# EAGLE design mDotBreakout (EAGLE 7.1.0)
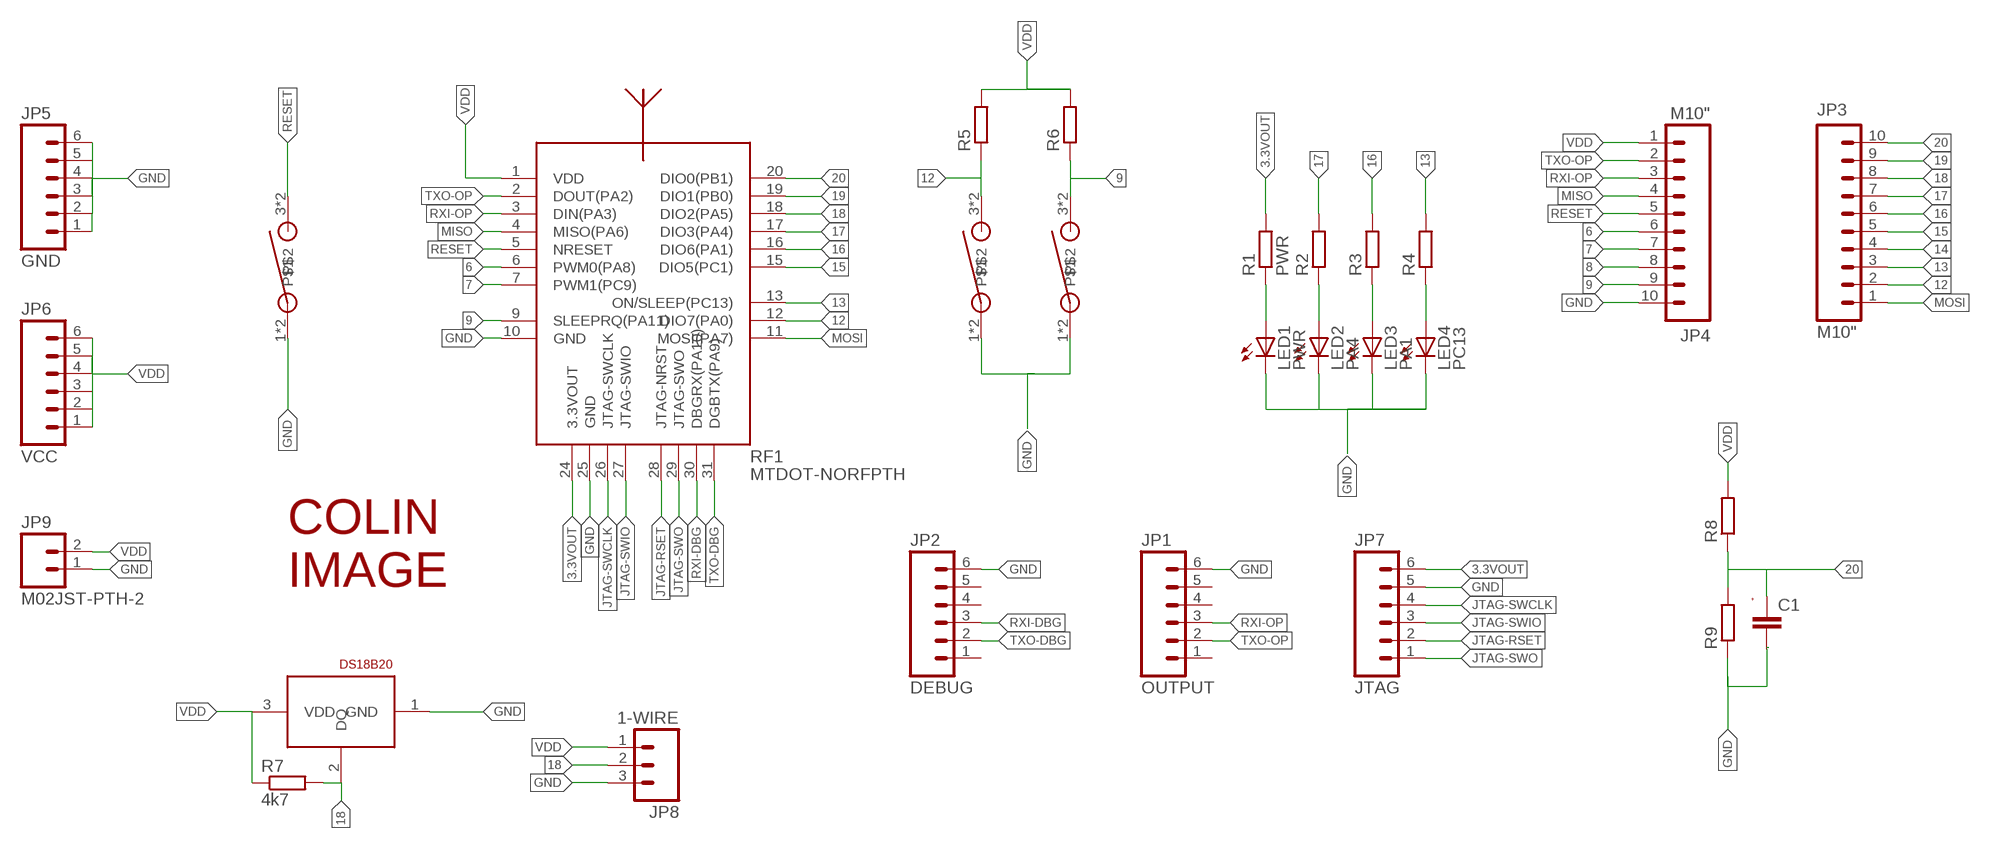
[diagram p0: schematic, sheet 1]

## Parts
C1  C-EUC0805K  [C0805K]
JP1  OUTPUT  M06SIP  [1X06]
JP2  DEBUG  M06SIP  [1X06]
JP3  M10"  [1X10]
JP4  M10"  [1X10]
JP5  GND  M06SIP  [1X06]
JP6  VCC  M06SIP  [1X06]
JP7  JTAG  M06SIP  [1X06]
JP8  1-WIRE  M03JST-PTH  [JST-3-PTH]
JP9  M02JST-PTH-2  [JST-2-PTH]
LED1  PWR  LEDCHIPLED_0805  [CHIPLED_0805]
LED2  PA4  LEDCHIPLED_0805  [CHIPLED_0805]
LED3  PA1  LEDCHIPLED_0805  [CHIPLED_0805]
LED4  PC13  LEDCHIPLED_0805  [CHIPLED_0805]
R1  PWR  R-EUR0805  [R0805]
R2  R-EUR0805  [R0805]
R3  R-EUR0805  [R0805]
R4  R-EUR0805  [R0805]
R5  R-EUR0805  [R0805]
R6  R-EUR0805  [R0805]
R7  4k7  R-EUR0805  [R0805]
R8  R-EUR0805  [R0805]
R9  R-EUR0805  [R0805]
RF1  MTDOT-NORFPTH  [MTDOT-M1-TRC-PTH-NORF]
RST  SWITCH_SPSTPTS645_SMT  [PTS645_SMT]
U$2  SWITCH_SPSTPTS645_SMT  [PTS645_SMT]
U$3  SWITCH_SPSTPTS645_SMT  [PTS645_SMT]
U$4  DS18B20TO92  [TO92]
U$5  COLIN  [COLIN]

## Nets
3.3VOUT: JP7.6 R1.2 RF1.24(3.3VOUT)
6: JP4.6 RF1.6(PWM0(PA8))
7: JP4.7 RF1.7(PWM1(PC9))
8: JP4.8
9: JP4.9 R6.1 RF1.9(SLEEPRQ(PA11)) U$3.3 U$3.4
12: JP3.2 R5.1 RF1.12(DIO7(PA0)) U$2.3 U$2.4
13: JP3.3 R4.2 RF1.13(ON/SLEEP(PC13))
14: JP3.4
15: JP3.5 RF1.15(DIO5(PC1))
16: JP3.6 R3.2 RF1.16(DIO6(PA1))
17: JP3.7 R2.2 RF1.17(DIO3(PA4))
18: JP3.8 JP8.2 R7.2 RF1.18(DIO2(PA5)) U$4.2(DQ)
19: JP3.9 RF1.19(DIO1(PB0))
20: C1.1 JP3.10 R8.1 R9.2 RF1.20(DIO0(PB1))
GND: C1.2 JP1.6 JP2.6 JP4.10 JP5.1 JP5.2 JP5.3 JP5.4 JP5.5 JP5.6 JP7.5 JP8.3 JP9.1 LED1.C LED2.C LED3.C LED4.C R9.1 RF1.10(GND) RF1.25(GND) RST.1 RST.2 U$2.1 U$2.2 U$3.1 U$3.2 U$4.1(GND)
JTAG-RSET: JP7.2 RF1.28(JTAG-NRST)
JTAG-SWCLK: JP7.4 RF1.26(JTAG-SWCLK)
JTAG-SWIO: JP7.3 RF1.27(JTAG-SWIO)
JTAG-SWO: JP7.1 RF1.29(JTAG-SWO)
MISO: JP4.4 RF1.4(MISO(PA6))
MOSI: JP3.1 RF1.11(MOSI(PA7))
N$1: LED1.A R1.1
N$2: LED2.A R2.1
N$3: LED3.A R3.1
N$4: LED4.A R4.1
RESET: JP4.5 RF1.5(NRESET) RST.3 RST.4
RXI-DBG: JP2.3 RF1.30(DBGRX(PA10))
RXI-OP: JP1.3 JP4.3 RF1.3(DIN(PA3))
TXO-DBG: JP2.2 RF1.31(DGBTX(PA9))
TXO-OP: JP1.2 JP4.2 RF1.2(DOUT(PA2))
VDD: JP4.1 JP6.1 JP6.2 JP6.3 JP6.4 JP6.5 JP6.6 JP8.1 JP9.2 R5.2 R6.2 R7.1 R8.2 RF1.1(VDD) U$4.3(VDD)
Unconnected: JP1.1 JP1.4 JP1.5 JP2.1 JP2.4 JP2.5

## Library data of the parts
C1 = mjholmes:C-EU: CAPACITOR, European symbol; SPICEPREFIX: C
JP1 JP2 JP5-JP7 = SparkFun-Connectors:M06: Header 6 Standard 6-pin 0.1" header. Use with straight break away headers (SKU : PRT-00116), right angle break away headers (PRT-00553), swiss pins (PRT-00743), machine pins (PRT-00117), and female headers (PRT-00115). Molex polarized connector foot print use with SKU : PRT-08094 with associated crimp pins and housings. NOTES ON THE VARIANTS LOCK and LOCK_LONGPADS... This footprint was designed to help hold the alignment of a through-hole component (i.e. 6-pin header) while soldering it into place. You may notice that each hole has been shifted either up or down by 0.005 of an inch from it's more standard position (which is a perfectly straight line). This slight alteration caused the pins (the squares in the middle) to touch the edges of the holes. Because they are alternating, it causes a "brace" to hold the component in place. 0.005 has proven to be the perfect amount of "off-center" position when using our standard breakaway headers. Although looks a little odd when you look at the bare footprint, once you have a header in there, the alteration is very hard to notice. Also,if you push a header all the way into place, it is covered up entirely on the bottom side. This idea of altering the position of holes to aid alignment will be further integrated into the Sparkfun Library for other footprints. It can help hold any component with 3 or more connection pins.
JP3 JP4 = SparkFun-Connectors:M10: Header 10 Standard 10-pin 0.1" header. Use with straight break away headers (SKU : PRT-00116), right angle break away headers (PRT-00553), swiss pins (PRT-00743), machine pins (PRT-00117), and female headers (PRT-00115).
JP8 = SparkFun-Connectors:M03: Header 3 Standard 3-pin 0.1" header. Use with straight break away headers (SKU : PRT-00116), right angle break away headers (PRT-00553), swiss pins (PRT-00743), machine pins (PRT-00117), and female headers (PRT-00115). Molex polarized connector foot print use with SKU : PRT-08232 with associated crimp pins and housings.; SKU: PRT-09915
JP9 = SparkFun-Connectors:M02: Standard 2-pin 0.1" header. Use with - straight break away headers ( PRT-00116) - right angle break away headers (PRT-00553) - swiss pins (PRT-00743) - machine pins (PRT-00117) - female headers (PRT-00115) Molex polarized connector foot print use with: PRT-08233 with associated crimp pins and housings. 2.54_SCREWTERM for use with PRT-10571. 3.5mm Screw Terminal footprints for PRT-08084 5mm Screw Terminal footprints for use with PRT-08433; SKU: PRT-09914
LED1-LED4 = led:LED: LED OSRAM: - CHIPLED LG R971, LG N971, LY N971, LG Q971, LY Q971, LO R971, LY R971 LH N974, LH R974 LS Q976, LO Q976, LY Q976 LO Q996 - Hyper CHIPLED LW Q18S LB Q993, LB Q99A, LB R99A - SideLED LS A670, LO A670, LY A670, LG A670, LP A670 LB A673, LV A673, LT A673, LW A673 LH A674 LY A675 LS A676, LA A676, LO A676, LY A676, LW A676 LS A679, LY A679, LG A679 - Hyper Micro SIDELED® LS Y876, LA Y876, LO Y876, LY Y876 LT Y87S - SmartLED LW L88C, LW L88S LB L89C, LB L89S, LG L890 LS L89K, LO L89K, LY L89K LS L896, LA L896, LO L896, LY L896 - TOPLED LS T670, LO T670, LY T670, LG T670, LP T670 LSG T670, LSP T670, LSY T670, LOP T670, LYG T670 LG T671, LOG T671, LSG T671 LB T673, LV T673, LT T673, LW T673 LH T674 LS T676, LA T676, LO T676, LY T676, LB T676, LH T676, LSB T676, LW T676 LB T67C, LV T67C, LT T67C, LS T67K, LO T67K, LY T67K, LW E67C LS E67B, LA E67B, LO E67B, LY E67B, LB E67C, LV E67C, LT E67C LW T67C LS T679, LY T679, LG T679 LS T770, LO T770, LY T770, LG T770, LP T770 LB T773, LV T773, LT T773, LW T773 LH T774 LS E675, LA E675, LY E675, LS T675 LS T776, LA T776, LO T776, LY T776, LB T776 LHGB T686 LT T68C, LB T68C - Hyper Mini TOPLED® LB M676 - Mini TOPLED Santana® LG M470 LS M47K, LO M47K, LY M47K Source: http://www.osram.convergy.de LUXEON: - LUMILED® LXK2-PW12-R00, LXK2-PW12-S00, LXK2-PW14-U00, LXK2-PW14-V00 LXK2-PM12-R00, LXK2-PM12-S00, LXK2-PM14-U00 LXK2-PE12-Q00, LXK2-PE12-R00, LXK2-PE12-S00, LXK2-PE14-T00, LXK2-PE14-U00 LXK2-PB12-K00, LXK2-PB12-L00, LXK2-PB12-M00, LXK2-PB14-N00, LXK2-PB14-P00, LXK2-PB14-Q00 LXK2-PR12-L00, LXK2-PR12-M00, LXK2-PR14-Q00, LXK2-PR14-R00 LXK2-PD12-Q00, LXK2-PD12-R00, LXK2-PD12-S00 LXK2-PH12-R00, LXK2-PH12-S00 LXK2-PL12-P00, LXK2-PL12-Q00, LXK2-PL12-R00 Source: www.luxeon.com KINGBRIGHT: KA-3528ASYC Source: www.kingbright.com
R1-R9 = mjholmes:R-EU: RESISTOR, European symbol; SPICEPREFIX: R
RF1 = mjholmes:MTDOT-NORF: Multitech MTDOT module - RF pads not exposed, antenna/connector on module
RST U$2 U$3 = mjholmes:SWITCH_SPST: Mountain switch Part number 101-TS6923T2605-EV http://www.mouser.com/ds/2/209/MS-100637-199674.pdf
U$4 = mjholmes:DS18B20: DS18B20 Programmable Resolution 1-Wire Digital Thermometer
U$5 = mjholmes:COLIN

## Board
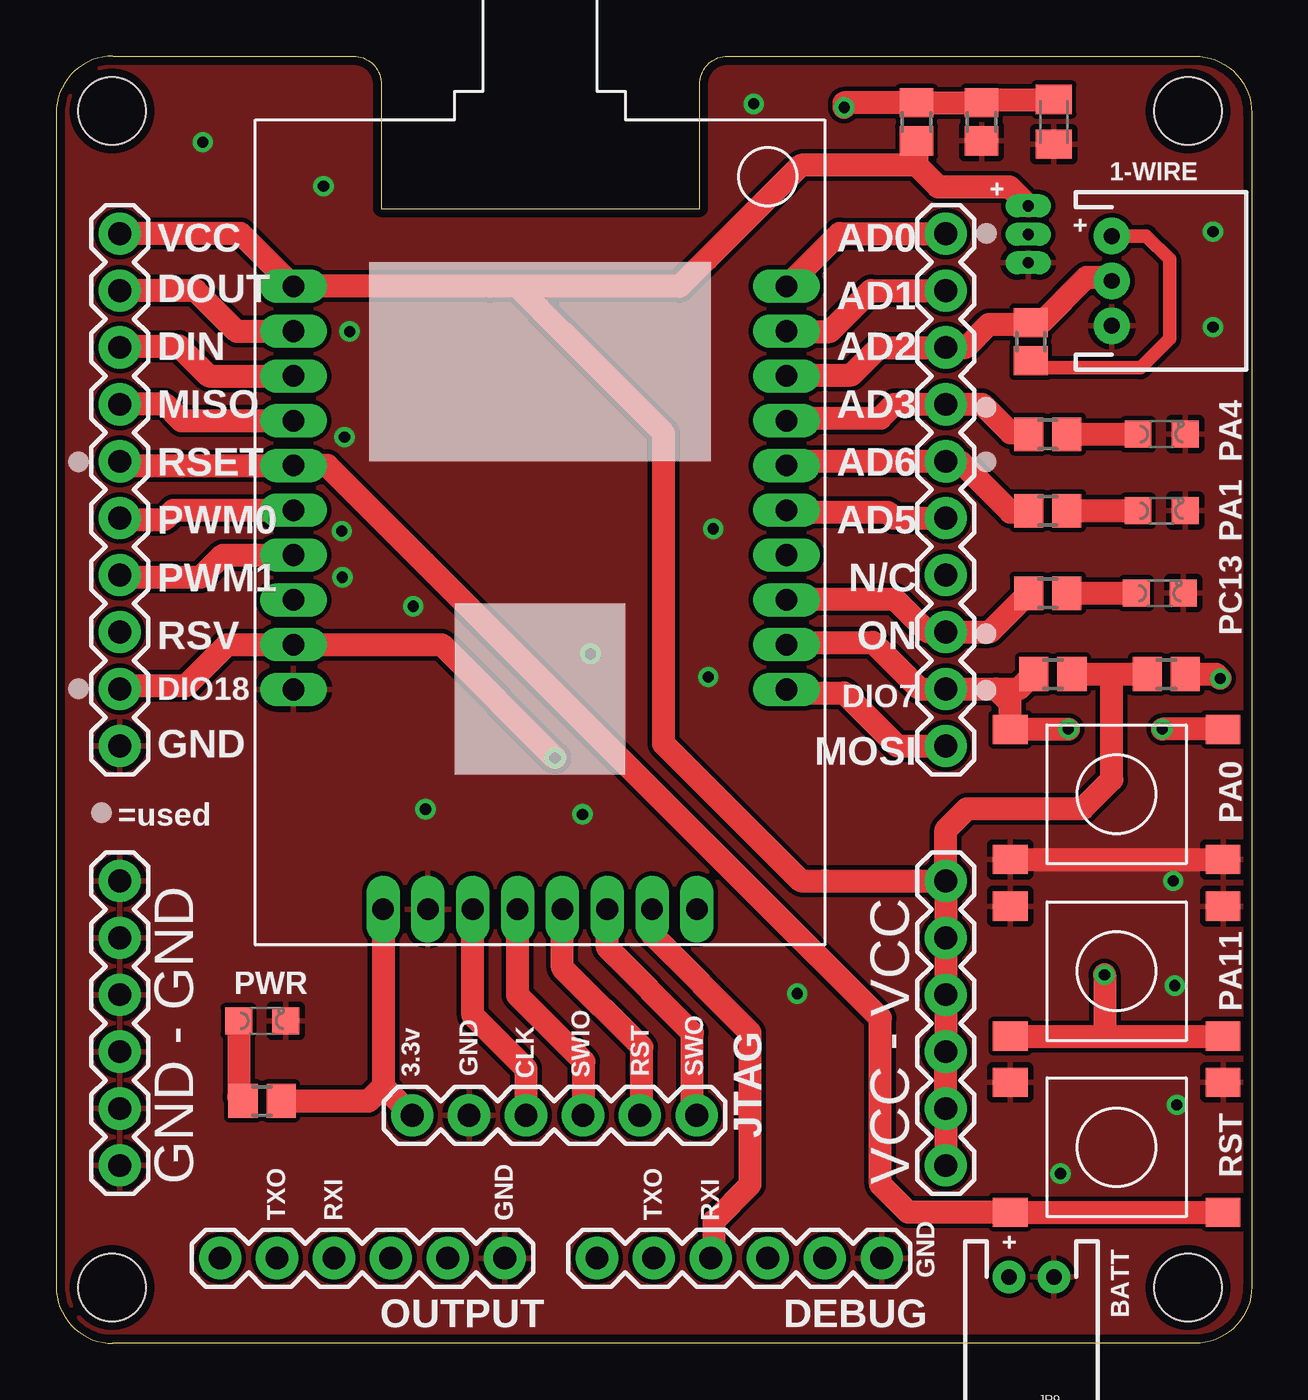
[diagram p1: board, top side]
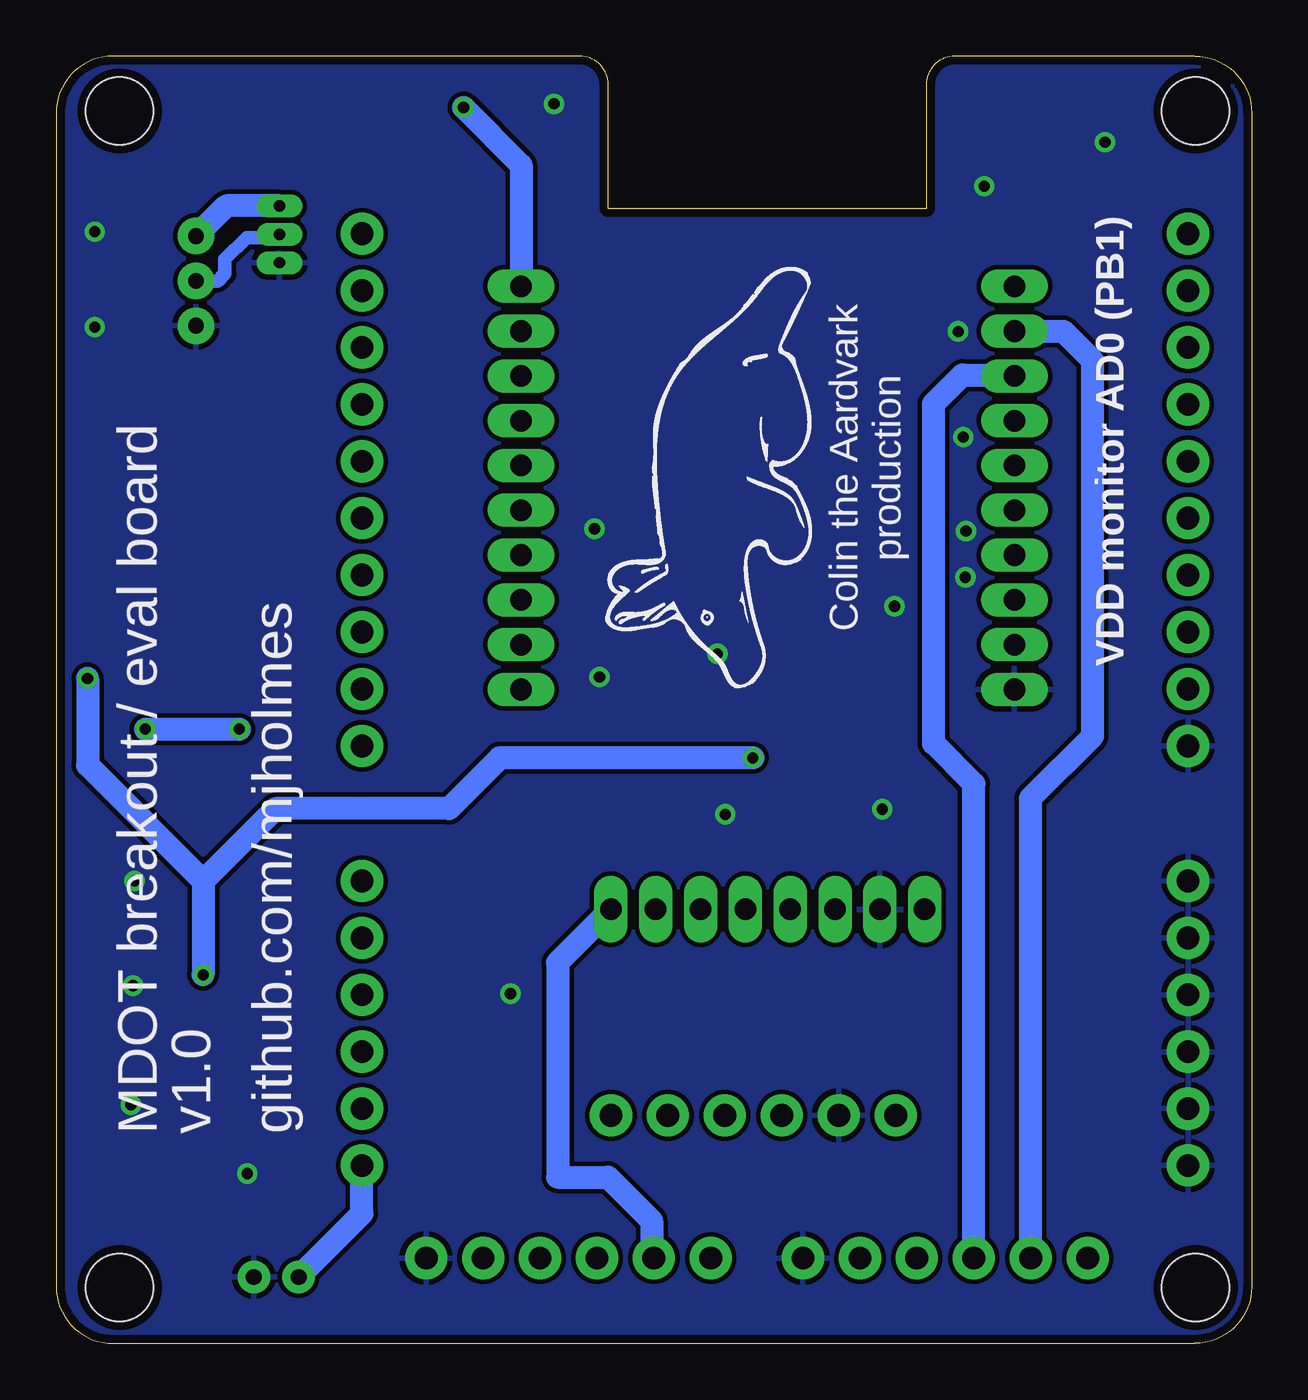
[diagram p2: board, bottom side, seen from below]

Size 53.34 x 57.45 mm. Coordinates in mm from the lower left corner, seen from the top.
Outline: 53.34,54.91 53.34,54.84
Outline: 53.34,54.84 53.34,2.54 arc-90 50.8,0 2.54,0 arc-90 0,2.54 0,54.91 arc-90 2.54,57.45 11.29,57.45
Outline: 11.29,57.45 11.43,57.45
Outline: 11.29,57.45 13.25,57.45 arc-90 14.52,56.19 14.52,50.65 28.71,50.65 28.71,56.19 arc-90 29.98,57.45 50.8,57.45 arc-90 53.34,54.91
Outline: 53.34,54.91 53.34,54.84
Copper layers (1*16): Top 0.035mm / dielectric 1.5mm / Bottom 0.035mm
Design rules "default *": minimum track width 10mil, minimum drill 15mil, track to track 8mil, track to pad 8mil, pad to pad 8mil, via to via 8mil, smd to smd 8mil, copper to edge 15mil, drill to drill 8mil, minimum pad ring 10mil, minimum via ring 8mil, stop-mask expansion 4mil, vias tented up to drill 20mil, thermal gap 10mil
Holes 3 mm at 2.5,55 2.5,2.5 50.5,55 50.5,2.5

### Footprints (pad centres in the part's own frame; a part is rotated, then mirrored left to right if it is on the bottom)
C0805K = smd 1.3 x 1.6: 1 -1,0; 2 1,0
1X06 = drill 1.016 pad 1.88: 1 0,0; 2 2.54,0; 3 5.08,0; 4 7.62,0; 5 10.16,0; 6 12.7,0
1X10 = drill 1.016 pad 1.88: 1 0,0; 2 2.54,0; 3 5.08,0; 4 7.62,0; 5 10.16,0; 6 12.7,0; 7 15.24,0; 8 17.78,0; 9 20.32,0; 10 22.86,0
JST-3-PTH = drill 0.7 pad 1.626: 1 -2,0; 2 0,0; 3 2,0
JST-2-PTH = drill 0.7 pad 1.448: 1 -1,0; 2 1,0
CHIPLED_0805 = smd 1.2 x 1.2: A 0,-1.05; C 0,1.05
R0805 = smd 1.3 x 1.5: 1 -0.85,0; 2 0.85,0
MTDOT-M1-TRC-PTH-NORF = drill 0.965 pad 1.499 long: 1 -11,3.998; 2 -11,1.999; 3 -11,0; 4 -11,-1.999; 5 -11,-3.998; 6 -11,-5.997; 7 -11,-7.996; 8 -11,-9.995; 9 -11,-11.994; 10 -11,-13.993; 11 11,-13.993; 12 11,-11.994; 13 11,-9.995; 14 11,-7.996; 15 11,-5.997; 16 11,-3.998; 17 11,-1.999; 18 11,0; 19 11,1.999; 20 11,3.998; 24 -7,-23.806; 25 -5,-23.806; 26 -3,-23.806; 27 -1,-23.806; 28 1,-23.806; 29 3,-23.806; 30 5,-23.806; 31 7,-23.806
PTS645_SMT = smd 1.55 x 1.3: 1 -4.75,2.9; 2 4.75,2.9; 3 -4.75,-2.9; 4 4.75,-2.9
TO92 = drill 0.508 long: 1 -1.27,0; 2 0,0; 3 1.27,0

### Placement (x,y rotation side)
C1  44.52,54.52 270 top
JP1  7.32,3.81 0 top
JP2  24.13,3.81 0 top
JP3  39.69,26.67 90 top
JP4  2.84,49.53 270 top
JP5  2.84,7.94 90 top
JP6  39.69,7.94 90 top
JP7  28.59,10.18 180 top
JP8  47.1,47.42 270 top
JP9  43.52,2.97 180 top
LED1  9.19,14.4 270 top
LED2  49.32,40.58 270 top
LED3  49.32,37.16 270 top
LED4  49.24,33.48 270 top
R1  9.19,10.83 0 top
R2  44.24,40.58 180 top
R3  44.24,37.16 180 top
R4  44.24,33.48 180 top
R5  44.47,29.88 0 top
R6  49.53,29.88 180 top
R7  43.48,44.71 90 top
R8  38.39,54.52 270 top
R9  41.29,54.52 90 top
RF1  21.59,43.18 0 top
RST  47.31,8.76 0 top
U$2  47.31,24.51 180 top
U$3  47.31,16.62 0 top
U$4  43.37,49.5 90 top
U$5  22.15,38.28 180 bottom

### Tracks (layer width: path | path; a pad name or v marks a point on that pad's centre or on a via)
3.3VOUT
  Top 1.016: RF1.24 14.59,11.47 | 14.59,11.47 JP7.6 | R1.2 13.94,10.82 14.59,11.47
6
  Top 1.016: JP4.6 2.9,36.77 4.84,36.77 5.25,37.18 RF1.6
7
  Top 1.016: JP4.7 2.94,34.19 6.45,34.19 7.44,35.18 RF1.7
9  (via drill 0.5)
  Top 1.016: JP4.9 2.99,29.36 5.81,29.36 7.64,31.19 RF1.9 17.2,31.19 v22.26,26.13 | U$3.3 46.77,13.71 | 46.77,13.71 U$3.4 | v46.77,16.45 46.77,13.71 | R6.1 51.74,29.88 v51.94,29.68
  Bottom 1.016: v22.26,26.13 33.55,26.13 35.81,23.87 43.55,23.87 46.77,20.64 | 46.77,20.64 v46.77,16.45 | v51.94,29.68 51.94,25.81 46.77,20.64
12  (via drill 0.5)
  Top 1.016: RF1.12 32.69,31.29 36.45,31.29 38.53,29.21 JP3.2 41.94,29.21 | 41.94,29.21 42.95,29.21 R5.1 | 41.94,29.21 42.56,28.58 U$2.4 45.15,27.41 v45.16,27.42 | U$2.3 v49.35,27.42
  Bottom 1.016: v49.35,27.42 v45.16,27.42
13
  Top 1.016: RF1.13 32.63,33.23 37.42,33.23 38.9,31.75 JP3.3 41.66,31.75 R4.2
15
  Top 1.016: RF1.15 32.68,37.1 37.1,37.1 37.36,36.83 JP3.5
16
  Top 1.016: RF1.16 32.78,39.37 JP3.6 40.31,39.37 42.58,37.1 43.32,37.1 R3.2
17
  Top 1.016: RF1.17 32.7,41.29 36.77,41.29 37.39,41.91 JP3.7 41.32,41.91 42.58,40.65 43.32,40.65 R2.2
18
  Top 1.016: RF1.18 32.64,43.23 35.48,43.23 36.71,44.45 JP3.8 40.58,44.45 41.61,45.48 43.4,45.48 R7.2 43.95,45.56 45.97,47.58 46.94,47.58 JP8.2
  Bottom 0.61: JP8.2 46.13,47.42 45.81,47.74 45.81,48.39 44.84,49.35 43.52,49.35 U$4.2
19
  Top 1.016: RF1.19 32.61,45.16 34.52,45.16 36.34,46.99 JP3.9
20  (via drill 0.5)
  Top 1.016: RF1.20 34.94,49.53 JP3.10 | R8.1 35.16,55.37 v35.16,55.16 | R8.1 | R8.1 R9.2 41.44,55.52 C1.1
  Bottom 1.016: v35.16,55.16 32.59,52.59 RF1.20
GND  (via drill 0.5)
  Top 1.016: U$2.2 U$2.1
  other vias: 13.1,45.16 12.87,40.45 12.74,36.26 29.1,29.74 15.94,32.9 23.48,23.61 23.84,30.77 12.77,34.19 16.48,23.84 33.06,15.61 29.32,36.35 6.55,53.61 11.94,51.65 31.13,55.32 51.61,49.61 51.61,45.35 49.84,20.65 49.9,15.97 50,10.65 44.81,7.58
  pour Top: 0,57.42 53.55,57.42 53.55,0 0,0
  pour Bottom: 0,57.42 53.23,57.42 53.23,0 0,0
JTAG-RSET
  Top 1.016: JP7.2 26.13,10.26 26.13,13.23 22.59,16.77 RF1.28
JTAG-SWCLK
  Top 1.016: JP7.4 20.97,10.97 20.97,12.26 18.59,14.64 RF1.26
JTAG-SWIO
  Top 1.016: JP7.3 23.55,10.22 23.55,12.58 20.59,15.54 RF1.27
JTAG-SWO
  Top 1.016: JP7.1 28.39,10.38 28.39,13.87 24.59,17.67 RF1.29
MISO
  Top 1.016: JP4.4 2.87,41.94 4.84,41.94 5.59,41.18 RF1.4
MOSI
  Top 1.016: RF1.11 32.74,29.03 35.16,29.03 37.52,26.67 JP3.1
N$1
  Top 1.016: LED1.A 8.14,11.02 R1.1
N$2
  Top 1.016: R2.1 LED2.A
N$3
  Top 1.016: R3.1 LED3.A
N$4
  Top 1.016: R4.1 LED4.A
RESET
  Top 1.016: JP4.5 3.03,39.18 RF1.5 12.11,39.18 16.45,34.84 36.77,14.52 36.77,7.1 38.01,5.86 RST.3 RST.4
RXI-DBG
  Top 1.016: JP2.3 29.36,3.96 29.36,5.48 30.97,7.1 30.97,13.87 26.59,18.25 RF1.30
RXI-OP
  Top 1.016: JP4.3 2.91,44.52 5.48,44.52 6.82,43.18 RF1.3
  Bottom 1.016: JP1.3 12.4,24.98 14.19,26.77 14.19,41.94 12.9,43.23 10.64,43.23 RF1.3
TXO-DBG
  Bottom 1.016: RF1.31 30.97,17 30.97,7.42 28.71,7.42 26.77,5.48 26.77,3.91 JP2.2
TXO-OP
  Top 1.016: RF1.2 10.57,45.16 8.06,45.16 6.24,46.99 JP4.2
  Bottom 1.016: JP1.2 9.86,24.34 7.1,27.1 7.1,43.87 8.39,45.16 10.57,45.16 RF1.2
VDD
  Top 0.61: JP8.1 48.65,49.42 49.68,48.39 49.68,44.84 48.39,43.55 43.8,43.55 R7.1
  Top 1.016: JP4.1 8.24,49.53 RF1.1 19.36,47.18 | JP6.6 JP6.5 JP6.4 JP6.3 JP6.2 39.68,10.5 39.68,10.64 39.69,10.63 JP6.1 | R8.2 38.39,52.58 | 38.39,52.58 39.35,51.61 42.53,51.61 U$4.3 | R5.2 46.77,29.88 | 46.77,29.88 R6.2 | JP6.6 39.69,22.92 40.65,23.87 45.81,23.87 47.1,25.16 47.1,29.55 46.77,29.88 | 19.36,47.18 20.56,47.18 22.58,45.16 27.1,40.65 27.1,26.77 33.23,20.64 JP6.6 | 38.39,52.58 33.23,52.58 29.03,48.39 27.82,47.18 19.36,47.18
  Bottom 1.016: U$4.3 45.74,50.77 JP8.1 | JP9.2 39.69,5.79 JP6.1

### Text on the board
bPlace: VDD monitor AD0 (PB1) | github.com/mjholmes | v1.0 | MDOT breakout / eval board
tNames: 1-WIRE | + | + | VCC | AD0 | DOUT | AD1 | DIN | AD2 | MISO | AD3 | RSET | AD6 | PA4 | PWM0 | AD5 | PA1 | PWM1 | N/C | PC13 | RSV | ON | DIO18 | DIO7 | GND | MOSI | =used | PA0 | PWR | PA11 | 3.3v | GND | CLK | SWIO | RST | SWO | JTAG | GND - GND | VCC - VCC | RST | TXO | RXI | GND | TXO | RXI | + | GND | OUTPUT | DEBUG | BATT